# EAGLE design power (EAGLE 7.0.0)
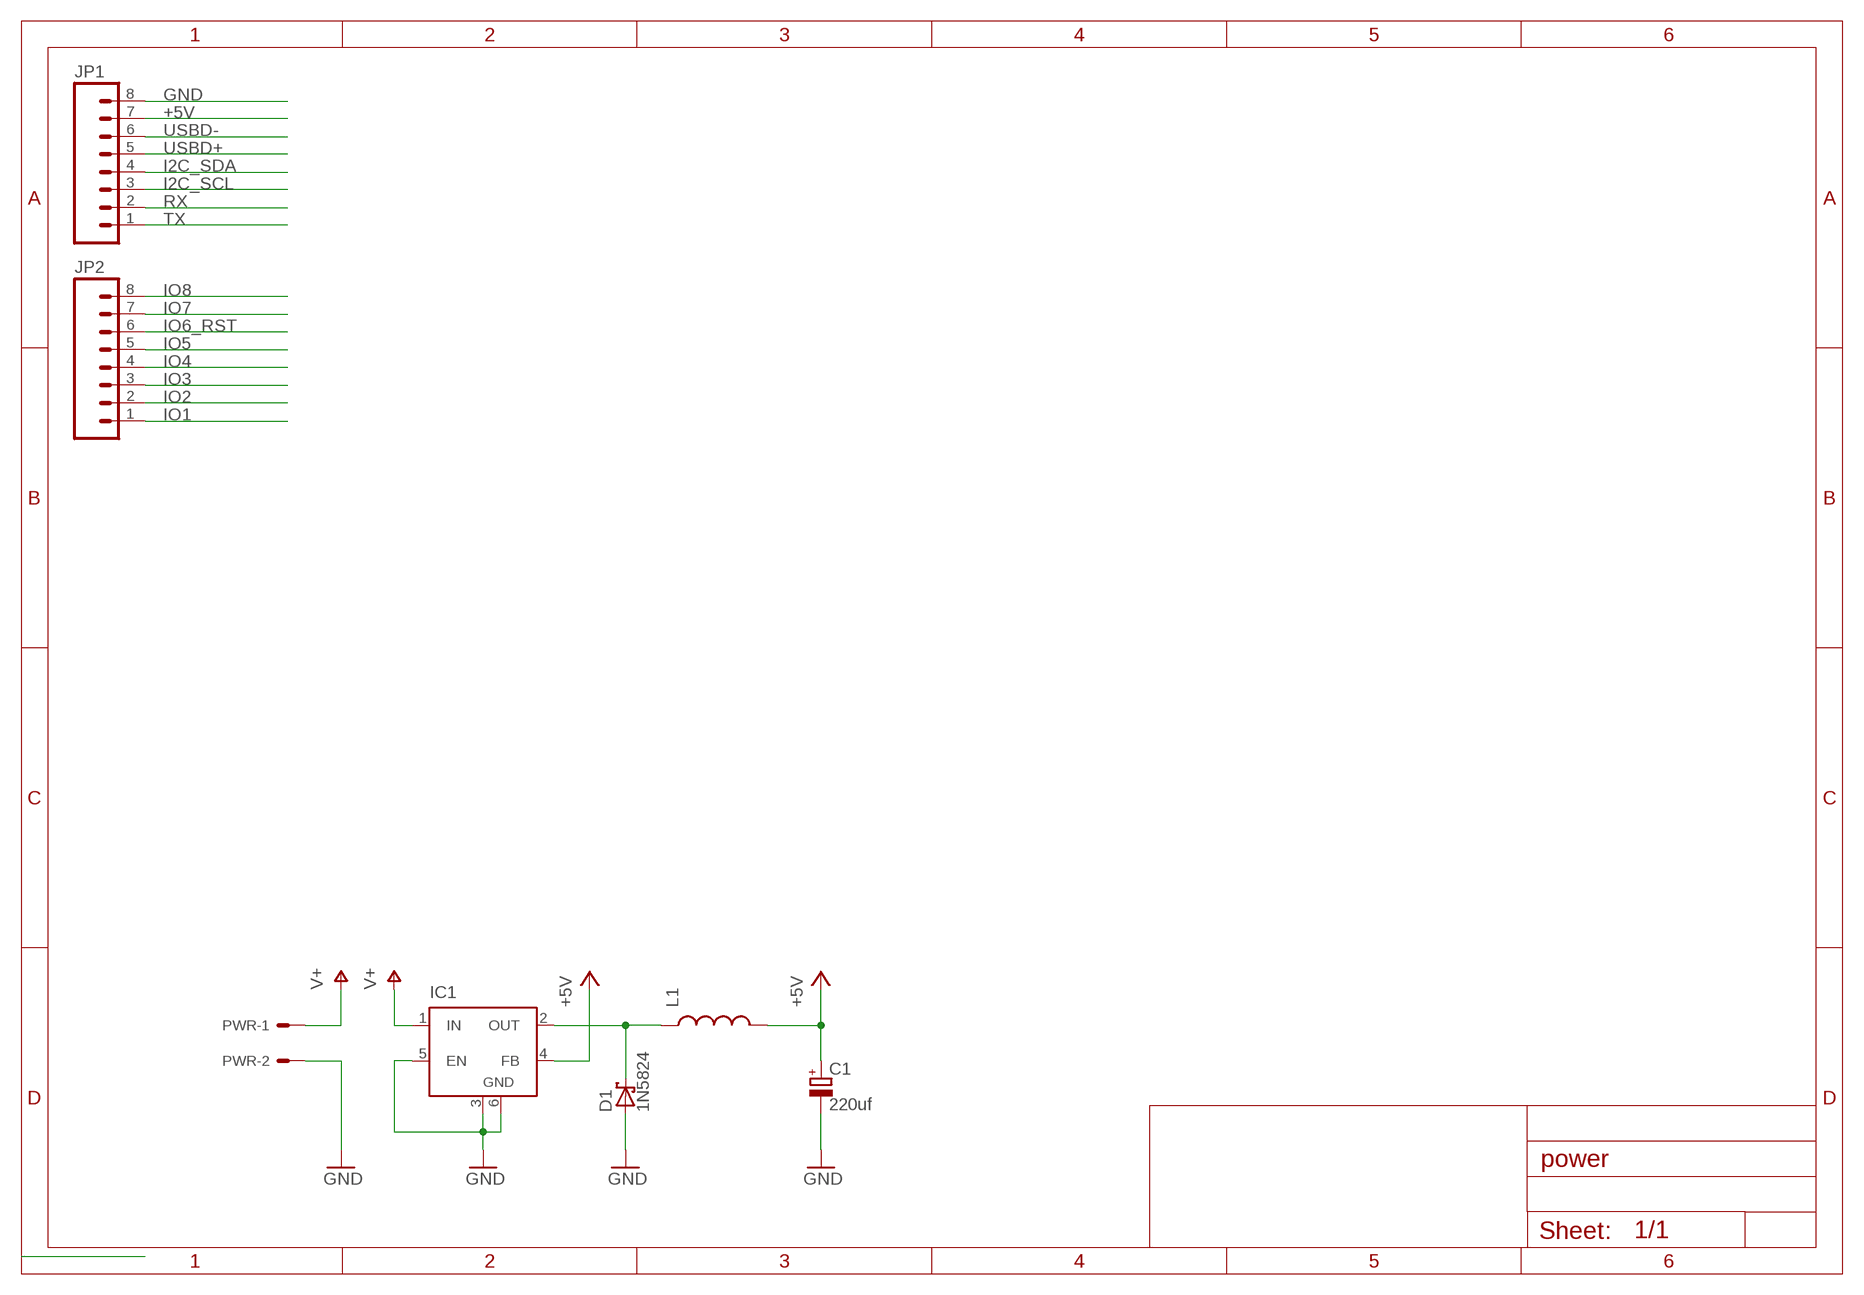
[diagram p0: schematic, sheet 1]

## Parts
C1  220uf  CPOL-EUE2.5-6  [E2,5-6]
D1  1N5824  1N5817-B  [DO41-7.6]
IC1  LM2596S  [TO263-5]
JP1  M081X08  [1X08]
JP2  M081X08  [1X08]
L1  INDUCTORSRU1038  [SRU1038]
PWR  22-05-7028-02  [7395-02]

## Nets
+5V: C1.+ IC1.4(FB) JP1.7 L1.2
GND: C1.- D1.A IC1.3(GND) IC1.5(EN) IC1.6(GND) JP1.8 PWR.2
I2C_SCL: JP1.3
I2C_SDA: JP1.4
IO1: JP2.1
IO2: JP2.2
IO3: JP2.3
IO4: JP2.4
IO5: JP2.5
IO6_RST: JP2.6
IO7: JP2.7
IO8: JP2.8
RX: JP1.2
TX: JP1.1
USBD+: JP1.5
USBD-: JP1.6
V+: IC1.1(IN) PWR.1
VOUT: D1.C IC1.2(OUT) L1.1

## Library data of the parts
C1 = rcl:CPOL-EU: POLARIZED CAPACITOR, European symbol
D1 = diode:1N581*: 1.0A SCHOTTKY BARRIER RECTIFIER Source: http://www.diodes.com/datasheets/ds23001.pdf
IC1 = linear:LM2596S: STEP-DOWN VOLTAGE REGULATOR
JP1 JP2 = SparkFun-Connectors:M08: Header 8 Standard 8-pin 0.1" header. Use with straight break away headers (SKU : PRT-00116), right angle break away headers (PRT-00553), swiss pins (PRT-00743), machine pins (PRT-00117), and female headers (PRT-00115).
L1 = SparkFun-Passives:INDUCTOR: Inductors Basic Inductor/Choke - 0603 and 1206. Footprints are not proven and vary greatly between part numbers. SRN6045- 33uH, 20% 1.4A SDR0403-560KL - 56uH, 10%, 500mA RMS/740mA peak
PWR = con-molex:22-?-02: CONNECTOR wire to board 2.54 mm (.1 inch) pitch header; OC_FARNELL: 9731601; OC_NEWARK: unknown

## Board
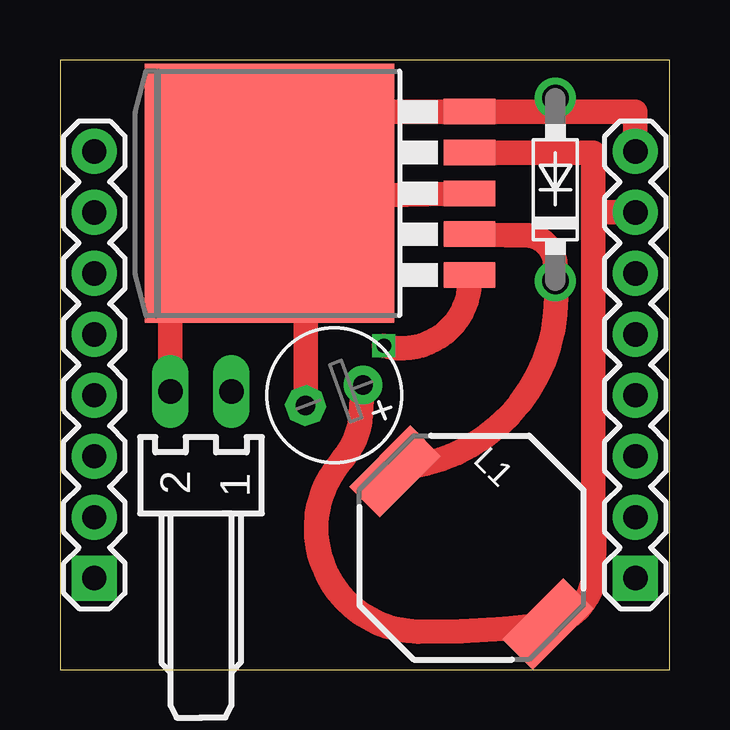
[diagram p1: board, top side]
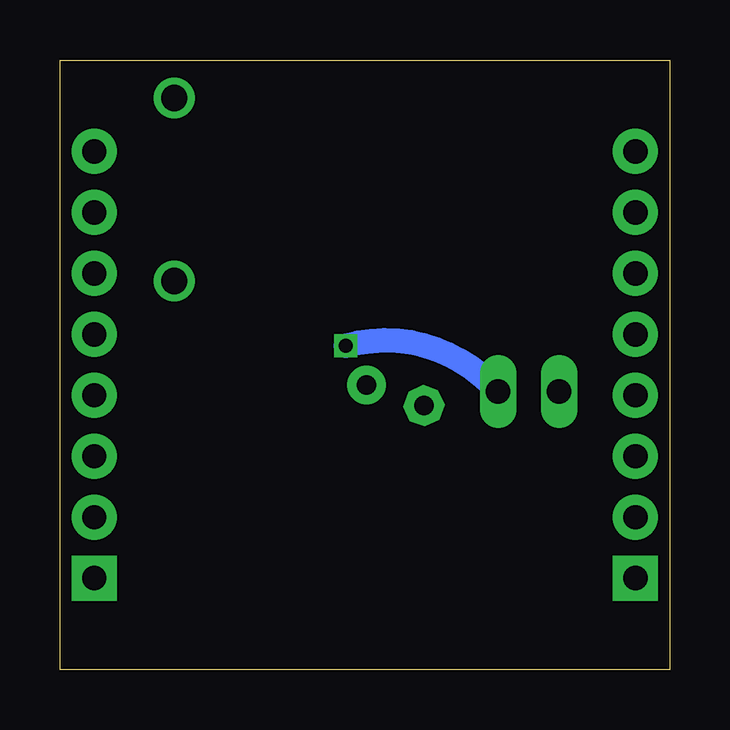
[diagram p2: board, bottom side, seen from below]

Size 25.4 x 25.4 mm. Coordinates in mm from the lower left corner, seen from the top.
Outline: 0,0 25.4,0 25.4,25.4 0,25.4 0,0
Copper layers (1*16): Top 0.0356mm / dielectric 1.5011mm / Bottom 0.0356mm
Design rules "LaenPCBOrder": minimum track width 6mil, minimum drill 13mil, track to track 6mil, track to pad 6mil, pad to pad 6mil, via to via 6mil, smd to smd 6mil, copper to edge 15mil, drill to drill 6mil, minimum pad ring 7mil, minimum via ring 7mil, stop-mask expansion 3mil, vias tented up to drill 0mil, thermal gap 10mil

### Footprints (pad centres in the part's own frame; a part is rotated, then mirrored left to right if it is on the bottom)
E2,5-6 = drill 0.813 pad 1.6: + -1.27,0 | drill 0.813 pad 1.6 octagon: - 1.27,0
DO41-7.6 = drill 1.1 pad 1.7: A 3.81,0; C -3.81,0
TO263-5 = smd 1.067 x 2.159: 1 -3.404,-5.791; 2 -1.702,-5.791; 3 0,-5.791; 4 1.702,-5.791; 5 3.404,-5.791 | smd 10.8 x 10.41: 6 0,2.54
1X08 = drill 1.016 pad 1.88 square: 1 0,0 | drill 1.016 pad 1.88: 2 2.54,0; 3 5.08,0; 4 7.62,0; 5 10.16,0; 6 12.7,0; 7 15.24,0; 8 17.78,0
SRU1038 = smd 1.8 x 3.6: 1 -4.5,0; 2 4.5,0
7395-02 = drill 1.016 long: 1 1.27,0; 2 -1.27,0

### Placement (x,y rotation side)
C1  11.43,11.43 200 top
D1  20.64,20 90 top
IC1  11.27,19.84 90 top
JP1  23.97,3.81 90 top
JP2  1.43,3.81 90 top
L1  17.14,5.08 315 top
PWR  5.87,11.59 0 top

### Tracks (layer width: path | path; a pad name or v marks a point on that pad's centre or on a via)
+5V
  Top 1.016: IC1.4 22.23,21.55 22.23,19.05 | C1.+ 12.54,10.64 arc-38 11.75,8.73 arc131 14.92,1.59 arc8 L1.2 arc81 22.23,3.97 arc5 22.23,7.14 22.23,19.05 | JP1.7 22.23,19.05
GND
  Top 1.016: C1.- 10.24,19.68 | 10.24,19.68 10.24,19.84 IC1.6 | PWR.2 4.6,19.84 IC1.6 | IC1.6 8.73,23.25 IC1.5 20.64,23.25 | D1.A 20.64,23.25 | JP1.8 23.97,23.25 20.64,23.25 | IC1.3 10.24,19.68
V+  (via drill 0.6)
  Top 1.016: v13.49,13.49 arc110 IC1.1
  Bottom 1.016: PWR.1 7.46,11.91 arc-61 v13.49,13.49
VOUT
  Top 1.016: IC1.2 arc2 19.37,18.1 arc-90 20.64,16.83 D1.C arc-82 15.24,8.57 L1.1